# Altium schematic sheet PCI104-Express.SchDoc: PCI/104-Express
size A3; Author: Lucas Liaño; Revision: 1; SheetNumber: 8; SheetTotal: 9
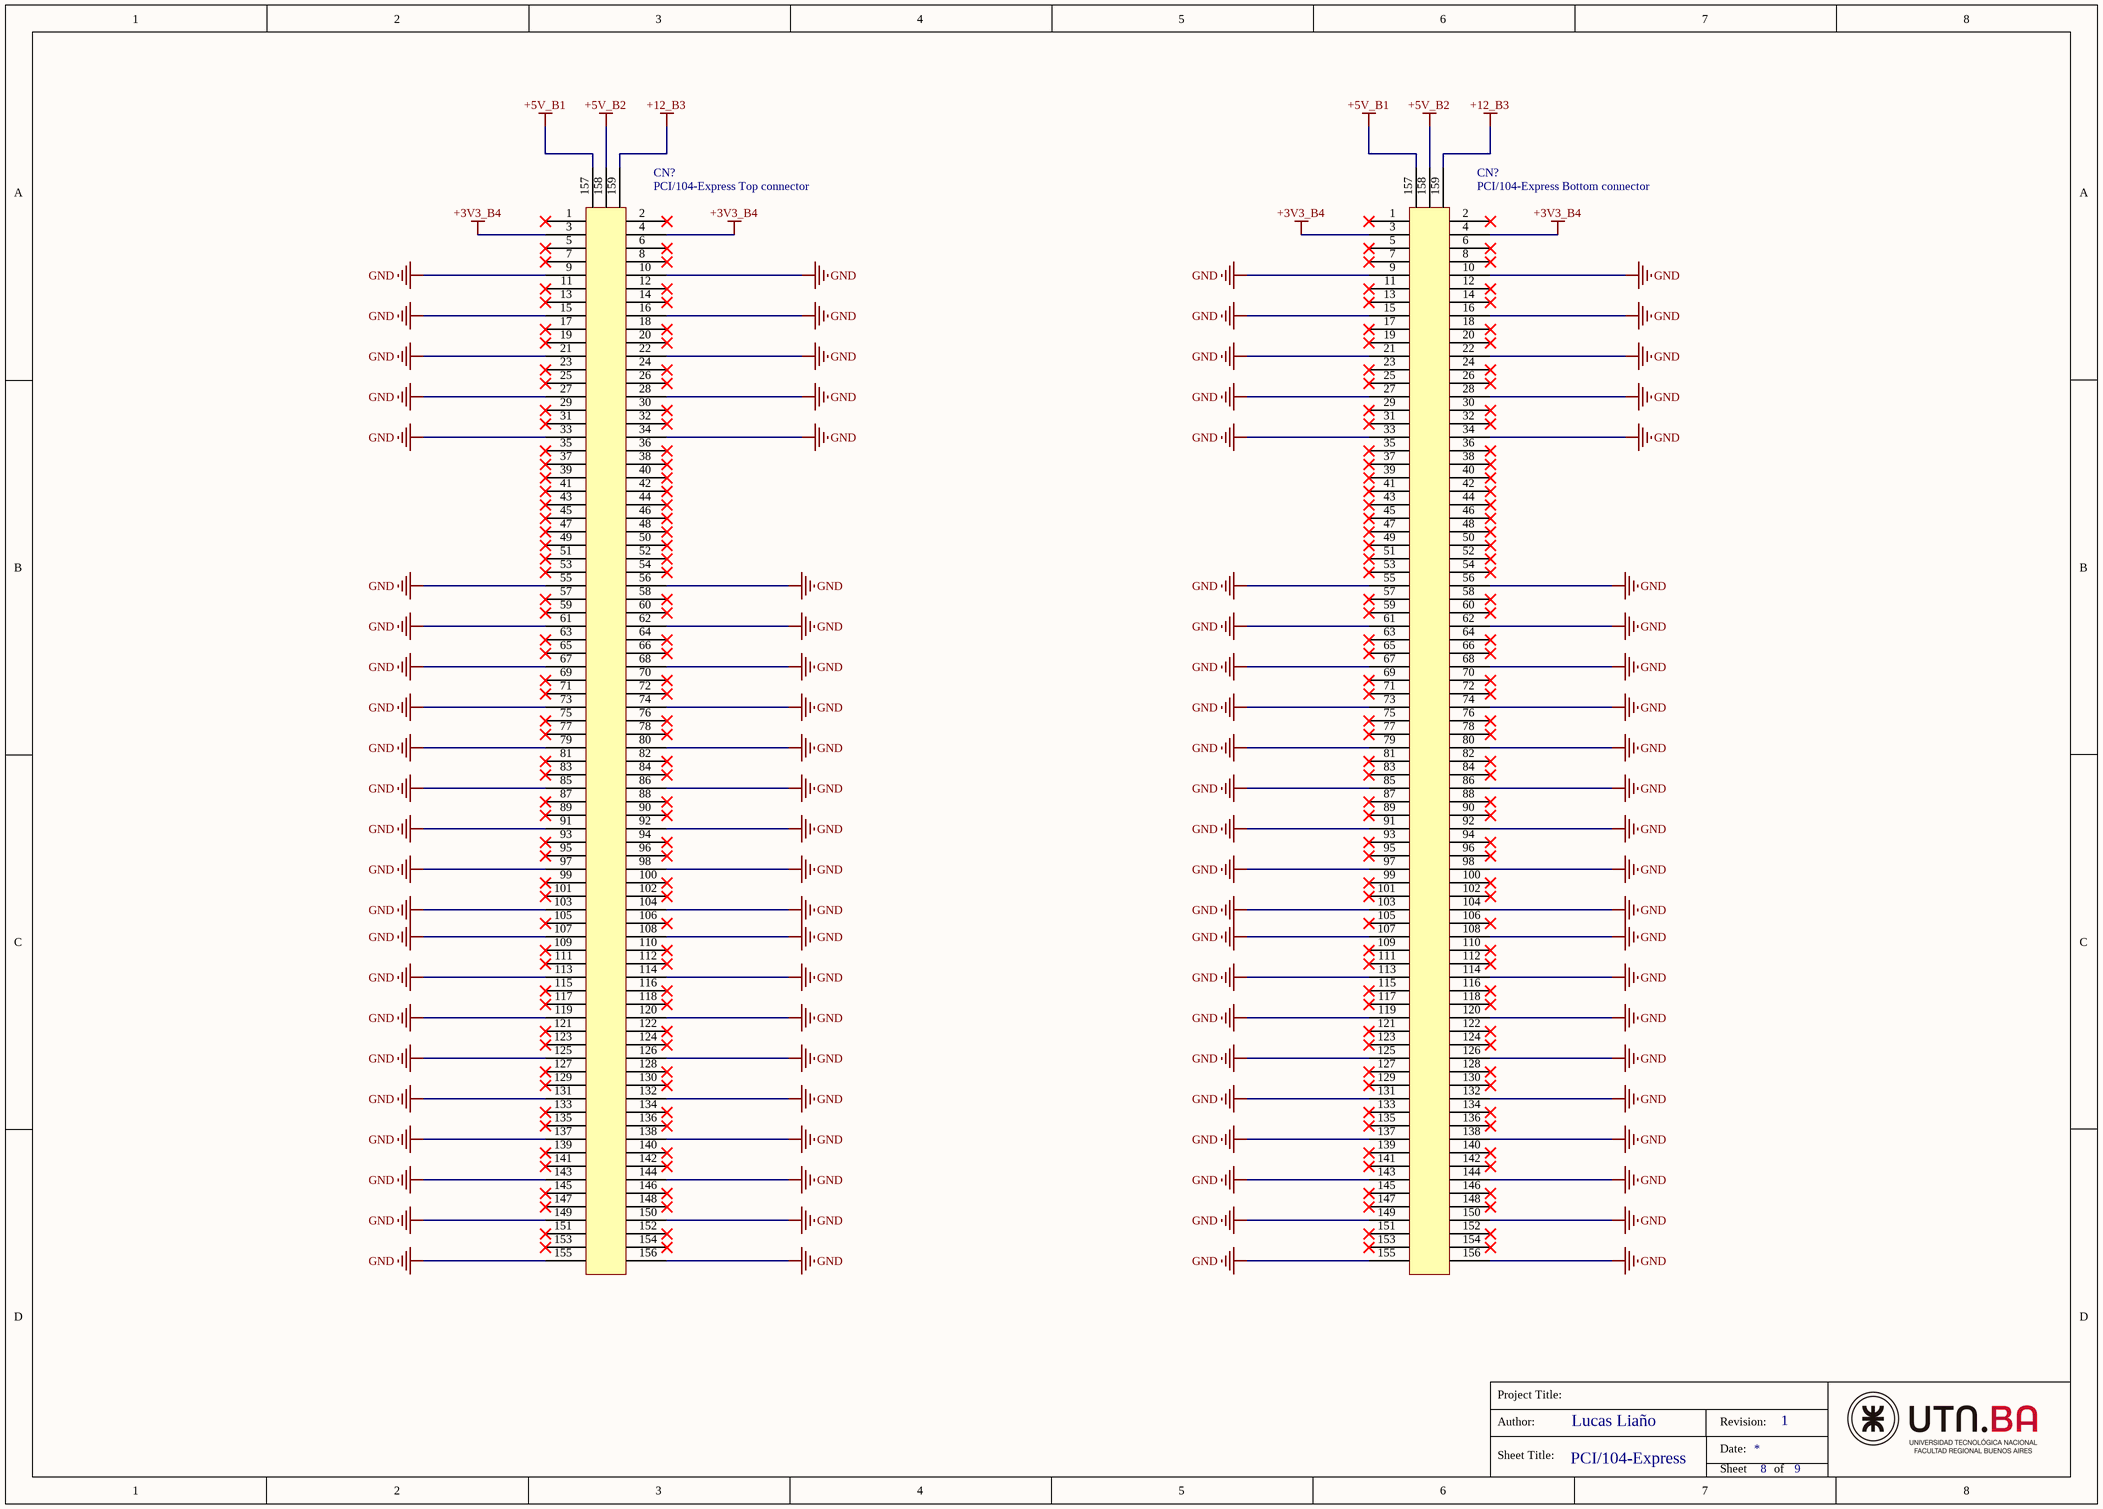
[diagram p0: PCI104-Express.SchDoc]

## Parts
(Parts that share a designator on the sheet are numbered #1, #2 ... from top to bottom, then left to right.)
CN?#1  PCI/104-Express Top connector
CN?#2  PCI/104-Express Bottom connector

## Nets
+3V3_B4: CN?#1.3 CN?#1.4 CN?#2.3 CN?#2.4
+5V_B1: CN?#1.157 CN?#2.157
+5V_B2: CN?#1.158 CN?#2.158
+12_B3: CN?#1.159 CN?#2.159
GND: CN?#1.9 CN?#1.10 CN?#1.15 CN?#1.16 CN?#1.21 CN?#1.22 CN?#1.27 CN?#1.28 CN?#1.33 CN?#1.34 CN?#1.55 CN?#1.56 CN?#1.61 CN?#1.62 CN?#1.67 CN?#1.68 CN?#1.73 CN?#1.74 CN?#1.79 CN?#1.80 CN?#1.85 CN?#1.86 CN?#1.91 CN?#1.92 CN?#1.97 CN?#1.98 CN?#1.103 CN?#1.104 CN?#1.107 CN?#1.108 CN?#1.113 CN?#1.114 CN?#1.119 CN?#1.120 CN?#1.125 CN?#1.126 CN?#1.131 CN?#1.132 CN?#1.137 CN?#1.138 CN?#1.143 CN?#1.144 CN?#1.149 CN?#1.150 CN?#1.155 CN?#1.156 CN?#2.9 CN?#2.10 CN?#2.15 CN?#2.16 CN?#2.21 CN?#2.22 CN?#2.27 CN?#2.28 CN?#2.33 CN?#2.34 CN?#2.55 CN?#2.56 CN?#2.61 CN?#2.62 CN?#2.67 CN?#2.68 CN?#2.73 CN?#2.74 CN?#2.79 CN?#2.80 CN?#2.85 CN?#2.86 CN?#2.91 CN?#2.92 CN?#2.97 CN?#2.98 CN?#2.103 CN?#2.104 CN?#2.107 CN?#2.108 CN?#2.113 CN?#2.114 CN?#2.119 CN?#2.120 CN?#2.125 CN?#2.126 CN?#2.131 CN?#2.132 CN?#2.137 CN?#2.138 CN?#2.143 CN?#2.144 CN?#2.149 CN?#2.150 CN?#2.155 CN?#2.156

Not connected (* = marked no-connect by the designer): CN?#1 1* 2* 5* 6* 7* 8* 11* 12* 13* 14* 17* 18* 19* 20* 23* 24* 25* 26* 29* 30* 31* 32* 35* 36* 37* 38* 39* 40* 41* 42* 43* 44* 45* 46* 47* 48* 49* 50* 51* 52* 53* 54* 57* 58* 59* 60* 63* 64* 65* 66* 69* 70* 71* 72* 75* 76* 77* 78* 81* 82* 83* 84* 87* 88* 89* 90* 93* 94* 95* 96* 99* 100* 101* 102* 105* 106* 109* 110* 111* 112* 115* 116* 117* 118* 121* 122* 123* 124* 127* 128* 129* 130* 133* 134* 135* 136* 139* 140* 141* 142* 145* 146* 147* 148* 151* 152* 153* 154*; CN?#2 1* 2* 5* 6* 7* 8* 11* 12* 13* 14* 17* 18* 19* 20* 23* 24* 25* 26* 29* 30* 31* 32* 35* 36* 37* 38* 39* 40* 41* 42* 43* 44* 45* 46* 47* 48* 49* 50* 51* 52* 53* 54* 57* 58* 59* 60* 63* 64* 65* 66* 69* 70* 71* 72* 75* 76* 77* 78* 81* 82* 83* 84* 87* 88* 89* 90* 93* 94* 95* 96* 99* 100* 101* 102* 105* 106* 109* 110* 111* 112* 115* 116* 117* 118* 121* 122* 123* 124* 127* 128* 129* 130* 133* 134* 135* 136* 139* 140* 141* 142* 145* 146* 147* 148* 151* 152* 153* 154*

## Notes on the sheet
- Project Title:
- Author:
- Sheet Title:
- Date:
- Revision:
- Sheet
- of

## Library data of the parts
CN?#1 = ASP-129637-03: Manufacturer: Samtec Inc.; ComponentLink1Description: Datasheet; ComponentLink1URL: http://suddendocs.samtec.com/prints/asp-129637-03-mkt.pdf; ComponentLink2Description: SupplierLink; ComponentLink2URL: https://www.digikey.com/en/products/detail/samtec-inc/ASP-129637-03/6561489?s=N4IgTCBcDaIIIGUAKBaAjGAnANgMwHYUAGXEAXQF8g; MPN: ASP-129637-03; Package: Connector; Price (USD): 30; Supplier: Digikey; Value: Top
CN?#2 = ASP-129646-03: Manufacturer: Samtec Inc.; ComponentLink1Description: Datasheet; ComponentLink1URL: http://suddendocs.samtec.com/prints/asp-129646-03-mkt.pdf; ComponentLink2Description: SupplierLink; ComponentLink2URL: https://www.digikey.com/es/products/detail/samtec-inc/ASP-129646-03/6561490; MPN: ASP-129646-03; Package: Connector; Price (USD): 30; Supplier: Digikey; Value: Bottom